# Altium schematic sheet 5V_Main.SchDoc
size A; SheetNumber: 6; SheetTotal: 9
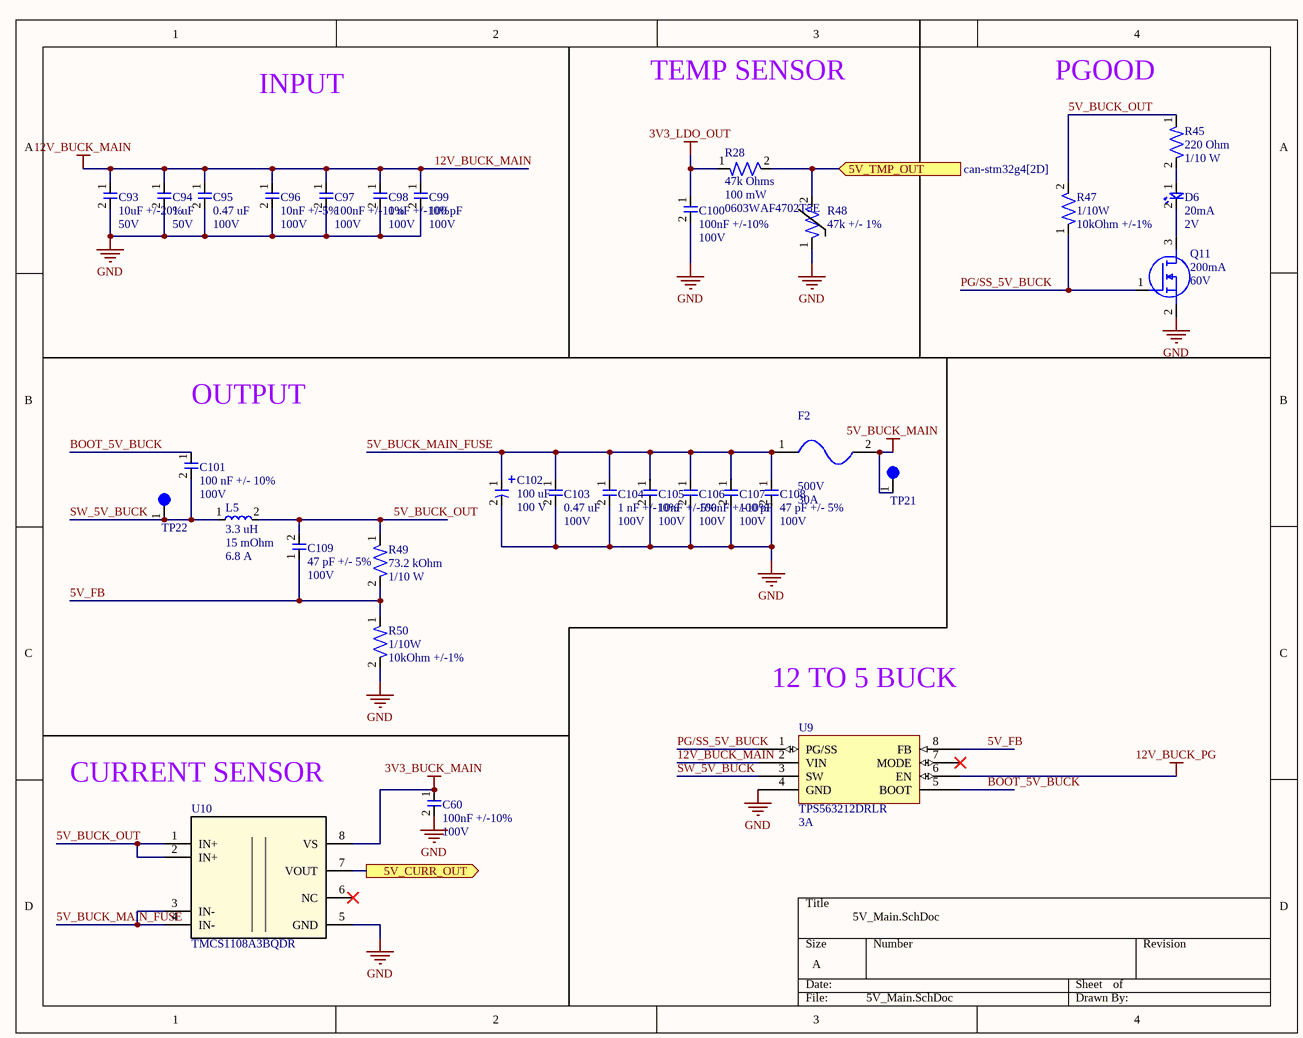
[diagram p0: 5V_Main.SchDoc]

## Parts
C60  Capacitance: 100nF +/-10%  Voltage Rating: 100V  [CAP-0603]  (hidden comment: CC0603KRX7R0BB104)
C93  Capacitance: 10uF +/-20%  Voltage Rating: 50V  [CAP-1206]  (hidden comment: CL31B106KBHNNNE)
C94  Capacitance: 1 uF  Voltage: 50V  [CAP-0603]  (hidden comment: UMK107AB7105KA-T)
C95  Capacitance: 0.47 uF  Voltage: 100V  [CAP-0805]  (hidden comment: KAM21KR72A474KL)
C96  Capacitance: 10nF +/-5%  Voltage Rating: 100V  [CAP-0603]  (hidden comment: C1608C0G2A103J080AC)
C97  Capacitance: 100nF +/-10%  Voltage Rating: 100V  [CAP-0603]  (hidden comment: CC0603KRX7R0BB104)
C98  Capacitance: 1 nF +/-10%  Voltage: 100V  [CAP-0603]  (hidden comment: C0603Y102K1RAC7867)
C99  Capacitance: 100 pF  Voltage: 100V  [CAP-0603]  (hidden comment: 0603N101J101CT)
C100  Capacitance: 100nF +/-10%  Voltage Rating: 100V  [CAP-0603]  (hidden comment: CC0603KRX7R0BB104)
C101  Capacitance: 100 nF +/- 10%  Voltage: 100V  [CAP-0603]  (hidden comment: CC0603KRX7R0BB104)
C102  Capacitance: 100 uF  Voltage: 100 V  [ELEC-100U-0001]  (hidden comment: 100SEV100M12.5X16)
C103  Capacitance: 0.47 uF  Voltage: 100V  [CAP-0805]  (hidden comment: KAM21KR72A474KL)
C104  Capacitance: 1 nF +/-10%  Voltage: 100V  [CAP-0603]  (hidden comment: C0603Y102K1RAC7867)
C105  Capacitance: 10nF +/-5%  Voltage Rating: 100V  [CAP-0603]  (hidden comment: C1608C0G2A103J080AC)
C106  Capacitance: 100nF +/-10%  Voltage Rating: 100V  [CAP-0603]  (hidden comment: CC0603KRX7R0BB104)
C107  Capacitance: 100 pF  Voltage: 100V  [CAP-0603]  (hidden comment: 0603N101J101CT)
C108  Capacitance: 47 pF +/- 5%  Voltage Rating: 100V  [CAP-0603]  (hidden comment: 7447798111)
C109  Capacitance: 47 pF +/- 5%  Voltage Rating: 100V  [CAP-0603]  (hidden comment: 7447798111)
D6  Current Rating: 20mA  Vf: 2V  [LED-0603]  (hidden comment: 150060AS75000)
F2  Voltage Rating: 500V  Current: 30A  [FUSE-ATM-0001]  (hidden comment: 3568)
L5  Inductance: 3.3 uH  DCR: 15 mOhm  DCI: 6.8 A  [PWRIND-3.3U-0003]  (hidden comment: SRR1240-3R3Y)
Q11  Id-Continuous: 200mA  VDS-Max: 60V  [NMOS-SOT23-3]  (hidden comment: T2N7002AK,LM)
R28  0603WAF4702T5E  [RES-0603]
R45  Resistance: 220 Ohm  Power: 1/10 W  [RES-0603]  (hidden comment: CRGCQ0603J220R)
R47  Power Rating: 1/10W  Resistance: 10kOhm +/-1%  [RES-0603]  (hidden comment: RC0603FR-0710KP)
R48  Resistance: 47k +/- 1%  [RES-0402]  (hidden comment: TMP6431DECR)
R49  Resistance: 73.2 kOhm  Power: 1/10 W  [RES-0603]  (hidden comment: RC0603FR-0773K2L)
R50  Power Rating: 1/10W  Resistance: 10kOhm +/-1%  [RES-0603]  (hidden comment: RC0603FR-0710KP)
TP21  5003  [TEST-POINT-0001]  (value not drawn)
TP22  5003  [TEST-POINT-0001]  (value not drawn)
U9  TPS563212DRLR  Current: 3A  [IC-SOT583]
U10  TMCS1108A3BQDR  [D0008A-IPC_A]

## Ports
5V_CURR_OUT (out, see can-stm32g4[2D]), 5V_TMP_OUT (in, see can-stm32g4[2D])

## Nets
3V3_BUCK_MAIN: C60.1 U10.8(VS)
3V3_LDO_OUT: C100.1 R28.1
5V_BUCK_MAIN: F2.2 TP21.1
12V_BUCK_MAIN: C93.1 C94.1 C95.1 C96.1 C97.1 C98.1 C99.1 U9.2(VIN)
12V_BUCK_PG: U9.6(EN)
GND: C60.2 C93.2 C94.2 C95.2 C96.2 C97.2 C98.2 C99.2 C100.2 C102.2 C103.2 C104.2 C105.2 C106.2 C107.2 C108.2 Q11.2(S) R48.1 R50.2 U9.4(GND) U10.5(GND)
5V_BUCK_MAIN_FUSE: C102.1 C103.1 C104.1 C105.1 C106.1 C107.1 C108.1 F2.1 U10.3(IN-) U10.4(IN-)
5V_BUCK_OUT: C109.2 L5.2 R45.1 R47.2 R49.1 U10.1(IN+) U10.2(IN+)
5V_CURR_OUT: U10.7(VOUT) ; port 5V_CURR_OUT
5V_FB: C109.1 R49.2 R50.1 U9.8(FB)
5V_TMP_OUT: R28.2 R48.2 ; port 5V_TMP_OUT
BOOT_5V_BUCK: C101.1 U9.5(BOOT)
PG/SS_5V_BUCK: Q11.1(G) R47.1 U9.1(PG/SS)
SW_5V_BUCK: C101.2 L5.1 TP22.1 U9.3(SW)
NetD6_1: D6.1 R45.2
NetD6_2: D6.2 Q11.3(D)

Not connected (* = marked no-connect by the designer): U9 7(MODE)*; U10 6(NC)*

## Notes on the sheet
- INPUT
- TEMP SENSOR
- PGOOD
- (near C101) OUTPUT
- 12 TO 5 BUCK
- CURRENT SENSOR
- 5V_Main.SchDoc
- (in symbol RES-47k-0001-JLC) 47k Ohms; 100 mW

## Library data of the parts
C60 C97 C100 C106 = CAP-100N-0001: CAP CER 0.1UF 100V X7R 0603; Manufacturer: YAGEO; Assembled?: no; Manufacturer Part Number: CC0603KRX7R0BB104; Temperature Coefficient: X7R; Package Size: 0603
C93 = CAP-10U-0001: 10 µF ±10% 50V Ceramic Capacitor X7R 1206 (3216 Metric); Manufacturer: Samsung Electro-Mechanics; Assembled?: no; Manufacturer Part Number: CL31B106KBHNNNE; Temperature Coefficient: X7R; Package Size: 1206
C94 = CAP-1U-0002: 1 µF ±10% 50V Ceramic Capacitor X7R 0603 (1608 Metric); Package Size: 0603
C95 C103 = CAP-0.47U-0001: 0.47 µF ±10% 100V Ceramic Capacitor X7R 0805 (2012 Metric); Tolerance: +/- 10%; Assembled?: No; Temperature Coefficient: X7R; Package Size: 0805
C96 C105 = CAP-10N-0002: CAP CER 10000PF 100V C0G 0603; Manufacturer: TDK Corporation; Temperature Coefficient: C0G/NP0; Assembled?: no; Manufacturer Part Number: C1608C0G2A103J080AC; Package Size: 0603
C98 C104 = CAP-1N-0001: 1000 pF ±10% 100V Ceramic Capacitor X7R 0603 (1608 Metric)
C99 C107 = CAP-100P-0002: 100 pF ±5% 100V Ceramic Capacitor C0G, NP0 0603 (1608 Metric); Tolerance: +/-5%; Temp Coeff: C0G/NP0; Package Size: 0603
C101 = CAP-100N-0002-JLC: 100V 100nF X7R ±10% 0603 Multilayer Ceramic Capacitors MLCC - SMD/SMT ROHS; assembled?: yes; JLC Part Number: C113803
C102 = ELEC-100U-0001: 100 µF 100 V Aluminum Electrolytic Capacitors Radial, Can - SMD 2000 Hrs @ 85°C; Manufacturer: Rubycon; Tolerance: +/- 20%; Assembled?: No; ESR: idk check the datasheet i couldnt find it
C108 C109 = CAP-47P-0001: 47 pF ±5% 100V Ceramic Capacitor C0G, NP0 0603 (1608 Metric)
D6 = LED_Amber_0001: CAP CER 0.1UF 100V X7R 0603; Manufacturer: Wurth Electronik; Assembled?: no; Color: Amber; Manufacturer Part Number: 150060AS75000; Package Size: 0603
F2 = FUSE-ATM-0001: Fuse Holder 30 A 500V 1 Circuit Blade Through Hole; Manufacturer Part Number: 3568
L5 = PWRIND-3.3U-0003: 3.3 µH Shielded Drum Core, Wirewound Inductor 6.8 A 15mOhm Max Nonstandard; Isat: 6.5A; Tolerance: 30%; Assembled?: No
Q11 = NMOS-200MA-0001: MOSFET N-CH 60V 200MA SOT23; Manufacturer: Toshiba; FET type: N-Channel; Rds On-Max: 3.9Ohm; Vgs-Max: 20V; Assembled?: no; Manufacturer Part Number: T2N7002AK,LM; Package: SOT-23-3
R28 = RES-47k-0001-JLC: 100mW Thick Film Resistors 75V ±100ppm/℃ ±1% 47kΩ 0603 Chip Resistor - Surface Mount ROHS; Resistance: 47kOhms; Power: 100mW
R45 = RES-220-003: 220 Ohms ±5% 0.1W, 1/10W Chip Resistor 0603 (1608 Metric) Automotive AEC-Q200, Moisture Resistant Thick Film; Tolerance: +/- 5%; Package Size: 0603
R47 R50 = RES-10K-0002: RES SMD 10K OHM 1% 1/10W 0603; Manufacturer: YAGEO; Assembled?: no; Manufacturer Part Number: RC0603FR-0710KP; Package Size: 0603
R48 = THERM-47K-0001: PTC Thermistor 47 kOhms 0402 (1006 Metric); Manufacturer: Texas Instruments; Manufacturer Part Number: TMP6431DECR; Package Size: 0402
R49 = RES-73.2K-0001: 73.2 kOhms ±1% 0.1W, 1/10W Chip Resistor 0603 (1608 Metric) Moisture Resistant Thick Film; Assembled?: No; Tolerance: 1%; Package Size: 0603
TP21 TP22 = TEST-POINT-0001: Oranange PC Test Point, Miniature Phoisphor Bronze Silver Plating Through Hole Mounting Type
U9 = IC-BUCK-0008: Buck Switching Regulator IC Positive Adjustable 0.6V 1 Output 3A SOT-583; Manufacturer: Texaas Instruments; Assembled?: no; Manufacturer Part Number: TPS563212DRLR; Type: Buck; Package Size: SOT-583
U10 = IC-CURRENT-0005: Mfr_Name: Texas Instruments; TYPE: TYPE; RefDes: RefDes